# EAGLE design FT230X_LTC4053_PROTO_BB_MINI_USB_B_V1a (EAGLE 5.07)
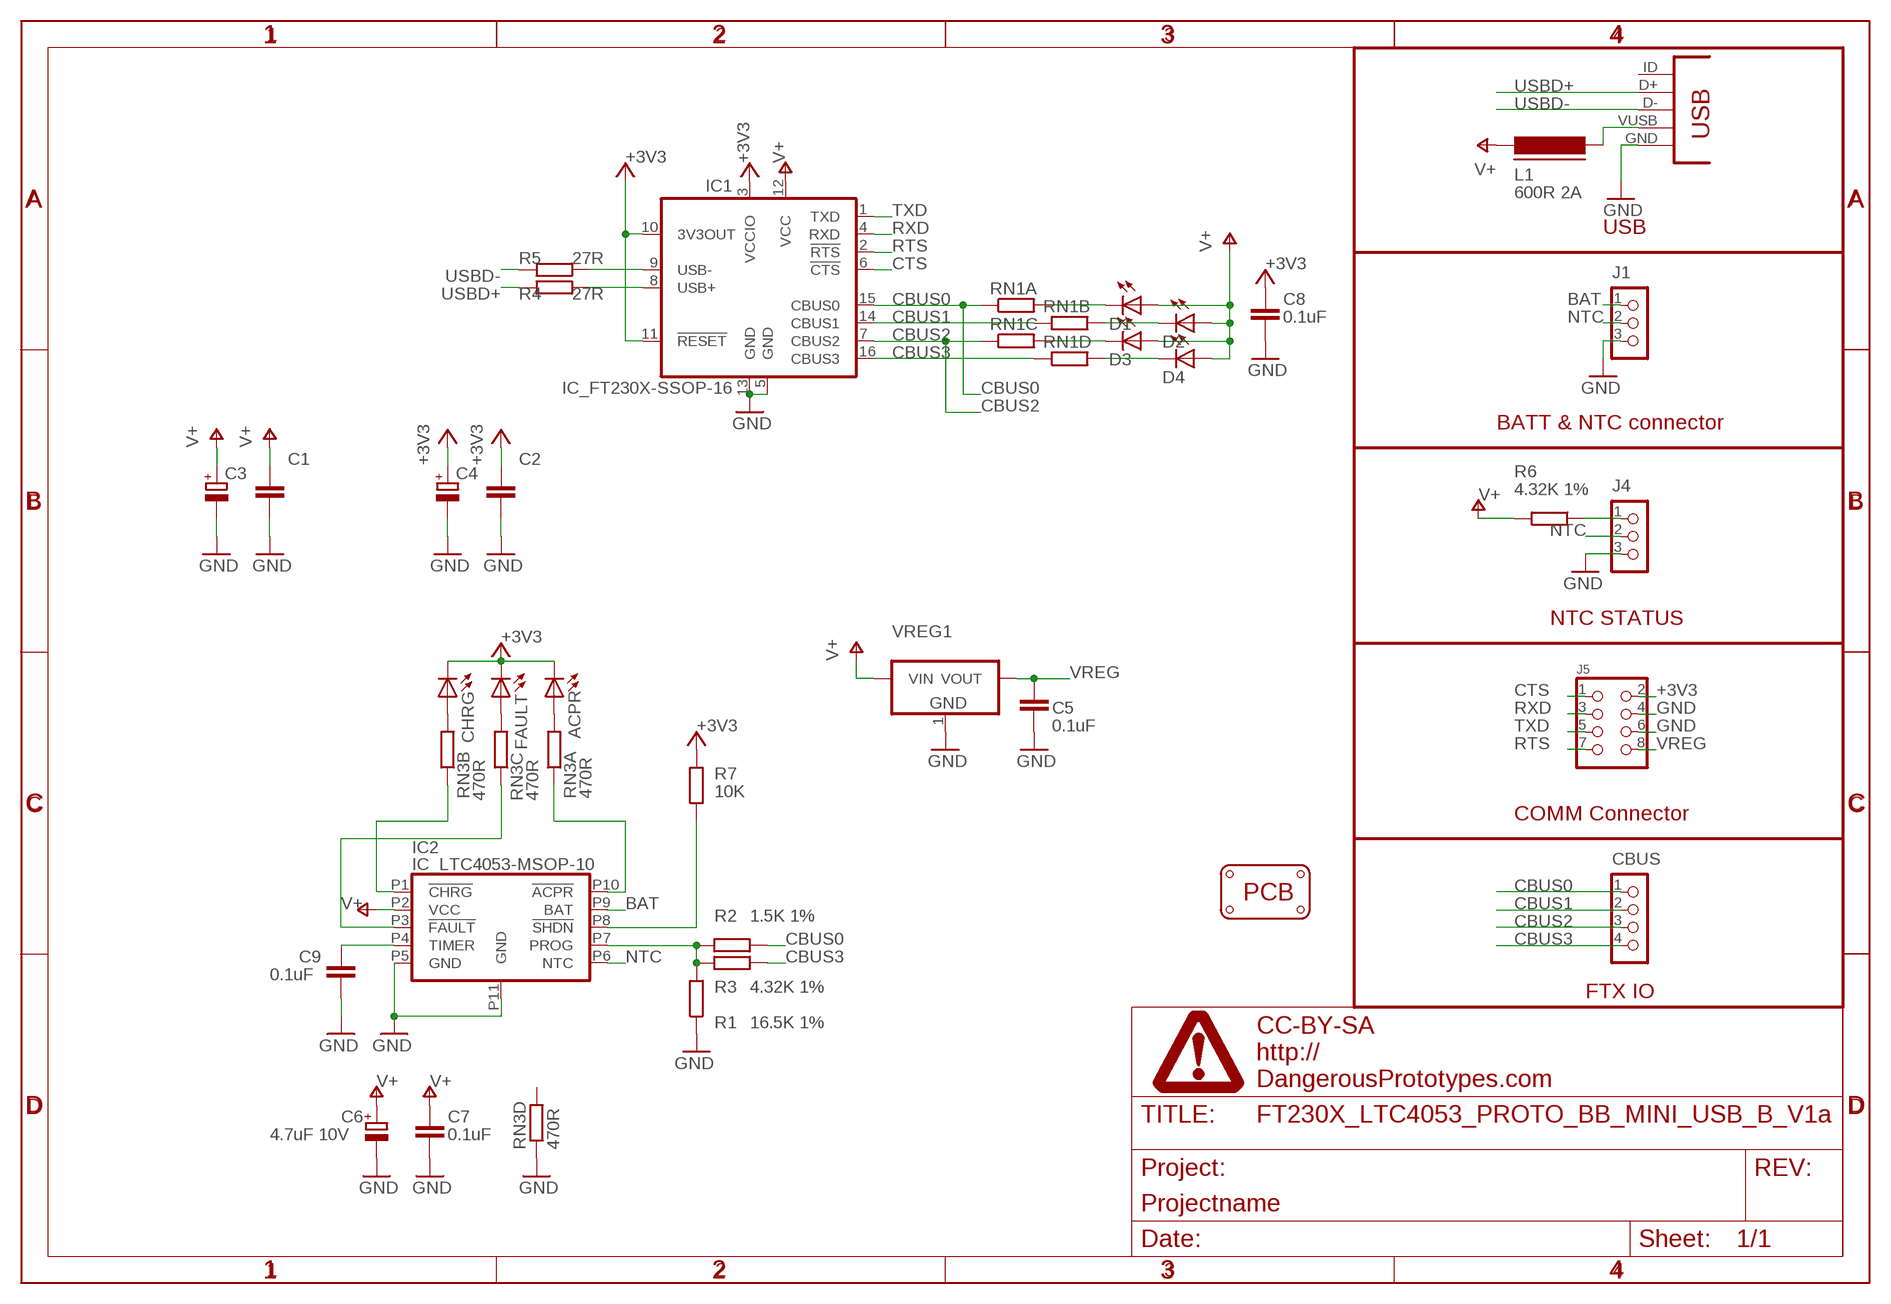
[diagram p0: schematic, sheet 1]

## Parts
ACPR  LED-0805  [LED-805]
C1  CAPACITOR_NPOL-0603  [C603]
C2  CAPACITOR_NPOL-0603  [C603]
C3  CAPACITOR_POL-SMC_A  [SMC_A]
C4  CAPACITOR_POL-SMC_A  [SMC_A]
C5  0.1uF  CAPACITOR_NPOL-0603  [C603]
C6  4.7uF 10V  CAPACITOR_POL-SMC_A  [SMC_A]
C7  0.1uF  CAPACITOR_NPOL-0603  [C603]
C8  0.1uF  CAPACITOR_NPOL-0603  [C603]
C9  0.1uF  CAPACITOR_NPOL-0603  [C603]
CBUS  CON_HEADER_1X04  [M1X4]
CHRG  LED-0805  [LED-805]
D1  LED-0805  [LED-805]
D2  LED-0805  [LED-805]
D3  LED-0805  [LED-805]
D4  LED-0805  [LED-805]
FAULT  LED-0805  [LED-805]
IC1  IC_FT230X-SSOP-16  [SSOP-16-FTDI]
IC2  IC_LTC4053-MSOP-10  [MSOP-10]
J1  CON_HEADER_1X03-PTH  [M1X3]
J4  CON_HEADER_1X03-PTH  [M1X3]
J5  CON_HEADER_2X04-PTH  [M2X4]
L1  600R 2A  FERRITE-0603  [FB603]
PCB2  PCB_DP_RECTANGLE-43X70  [DP7043_V1]
R1  16.5K 1%  RESISTOR-0603  [R603]
R2  1.5K 1%  RESISTOR-0603  [R603]
R3  4.32K 1%  RESISTOR-0603  [R603]
R4  27R  RESISTOR-0603  [R603]
R5  27R  RESISTOR-0603  [R603]
R6  4.32K 1%  RESISTOR-0603  [R603]
R7  10K  RESISTOR-0603  [R603]
RN1  RESISTOR_ARRAY_4  [RN8P-4R-CRA06S]
RN3  470R  RESISTOR_ARRAY_4  [RN8P-4R-CRA06S]
U$1  FRAME_DINA4_L  [DP_LOGO]
U$4  PROTO_VIAS_05X05  [PROTO_VIAS_05X05]  (not placed on a sheet)
U$6  PROTO_VIAS_05X05  [PROTO_VIAS_05X05]  (not placed on a sheet)
U$7  PROTO_VIAS_05X05  [PROTO_VIAS_05X05]  (not placed on a sheet)
U$8  PROTO_VIAS_05X05  [PROTO_VIAS_05X05]  (not placed on a sheet)
U$9  PROTO_VIAS_05X05  [PROTO_VIAS_05X05]  (not placed on a sheet)
U$10  PROTO_VIAS_05X05  [PROTO_VIAS_05X05]  (not placed on a sheet)
USB1  CON-USB-F-MINI-B  [CONN_USB_MINI-B]
VREG1  IC_VREG_3PINS-DPAK  [DPAK]

## Nets
+3V3: ACPR.C C2.1 C4.+ C8.1 CHRG.C FAULT.C IC1.3(VCCIO) IC1.10(3V3OUT) IC1.11(!RESET) J5.2 R7.2
BAT: IC2.P9(BAT) J1.1
CBUS0: CBUS.1 IC1.15(CBUS0) R2.2 RN1.1
CBUS1: CBUS.2 IC1.14(CBUS1) RN1.2
CBUS2: CBUS.3 IC1.7(CBUS2) RN1.3
CBUS3: CBUS.4 IC1.16(CBUS3) R3.2 RN1.4
CTS: IC1.6(!CTS) J5.1
GND: C1.2 C2.2 C3.- C4.- C5.2 C6.- C7.2 C8.2 C9.2 IC1.5(GND) IC1.13(GND) IC2.P5(GND) IC2.P11(GND) J1.3 J4.3 J5.4 J5.6 R1.1 RN3.4 USB1.GND VREG1.1(GND)
N$1: IC2.P10(!ACPR) RN3.1
N$2: IC2.P7(PROG) R1.2 R2.1 R3.1
N$3: IC2.P1(!CHRG) RN3.2
N$4: IC2.P3(!FAULT) RN3.3
N$5: D1.C RN1.8
N$6: D2.C RN1.7
N$7: D3.C RN1.6
N$8: D4.C RN1.5
N$9: IC2.P8(!SHDN) R7.1
N$10: J4.1 R6.1
N$11: IC1.8(USB+) R4.2
N$12: IC1.9(USB-) R5.2
N$13: C9.1 IC2.P4(TIMER)
N$14: FAULT.A RN3.6
N$15: CHRG.A RN3.7
N$16: ACPR.A RN3.8
NTC: IC2.P6(NTC) J1.2 J4.2
RTS: IC1.2(!RTS) J5.7
RXD: IC1.4(RXD) J5.3
TXD: IC1.1(TXD) J5.5
USBD+: R4.1 USB1.D+
USBD-: R5.1 USB1.D-
V+: C1.1 C3.+ C6.+ C7.1 D1.A D2.A D3.A D4.A IC1.12(VCC) IC2.P2(VCC) L1.1 R6.2 VREG1.3(VIN)
VREG: C5.1 J5.8 VREG1.2(VOUT)
VUSBE: L1.2 USB1.VUSB
Unconnected: RN3.5 USB1.BODY@1(BODY) USB1.BODY@2(BODY) USB1.BODY@3(BODY) USB1.BODY@4(BODY) USB1.ID(USBID)

## Notes on the sheet
- USB
- BATT & NTC connector
- NTC STATUS
- COMM Connector
- FTX IO

## Library data of the parts
ACPR CHRG D1-D4 FAULT = dp_devices:LED: Light Emitting Diode
C1 C2 C5 C7-C9 = dp_devices:CAPACITOR_NPOL: Non-Polarized capacitor in various packages
C3 C4 C6 = dp_devices:CAPACITOR_POL: Polarized capacitor in various packages
CBUS = dp_devices:CON_HEADER_1X04
IC1 = dp_devices:IC_FT230X: BASIC USB to UART IC
IC2 = dp_devices:IC_LTC4053: USB Compatible Li-Ion Battery Charger
J1 J4 = dp_devices:CON_HEADER_1X03
J5 = dp_devices:CON_HEADER_2X04
L1 = dp_devices:FERRITE: Ferrite bead in various packages
PCB2 = dp_devices:PCB_DP_RECTANGLE: Dangerous Prototypes Standard Rectangular PCB sizes
R1-R7 = dp_devices:RESISTOR
RN1 RN3 = dp_devices:RESISTOR_ARRAY_4: 4 Resistor Array 0603
U$1 = dp_devices:FRAME_DINA4_L: A4 DP frame Standard Dangerous Prototypes schematic frame. Automagically adds the DP logo and standard texts to the PCB Use the atrribute in the schematic editor to change the fields.; FF1: fulfillment by; FF2: Seeed Studio; FF3: www.seeedstudio.com; LICENSE: CC-BY-SA; PROJECT: Projectname; URL1: http://; URL2: DangerousPrototypes.com
U$4 U$6-U$10 = dp_devices:PROTO_VIAS_05X05: 5x5 square pad 0.04 inch prototyping block
USB1 = dp_devices:CON-USB-F: USB Female connector
VREG1 = dp_devices:IC_VREG_3PINS: Various 3 pin voltage regulators in different packages Double check the right pinout for the right part

## Board
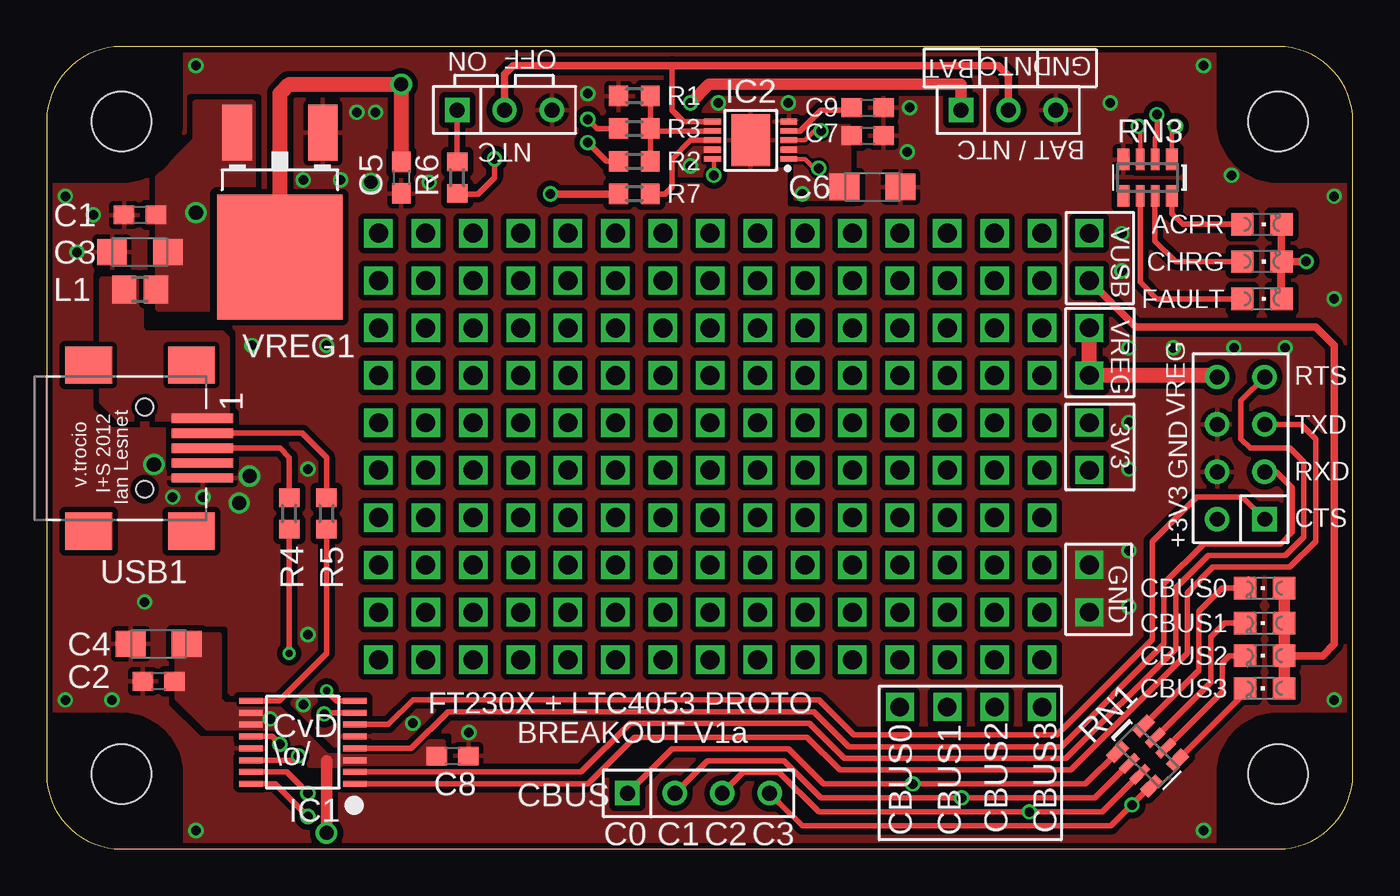
[diagram p1: board, top side]
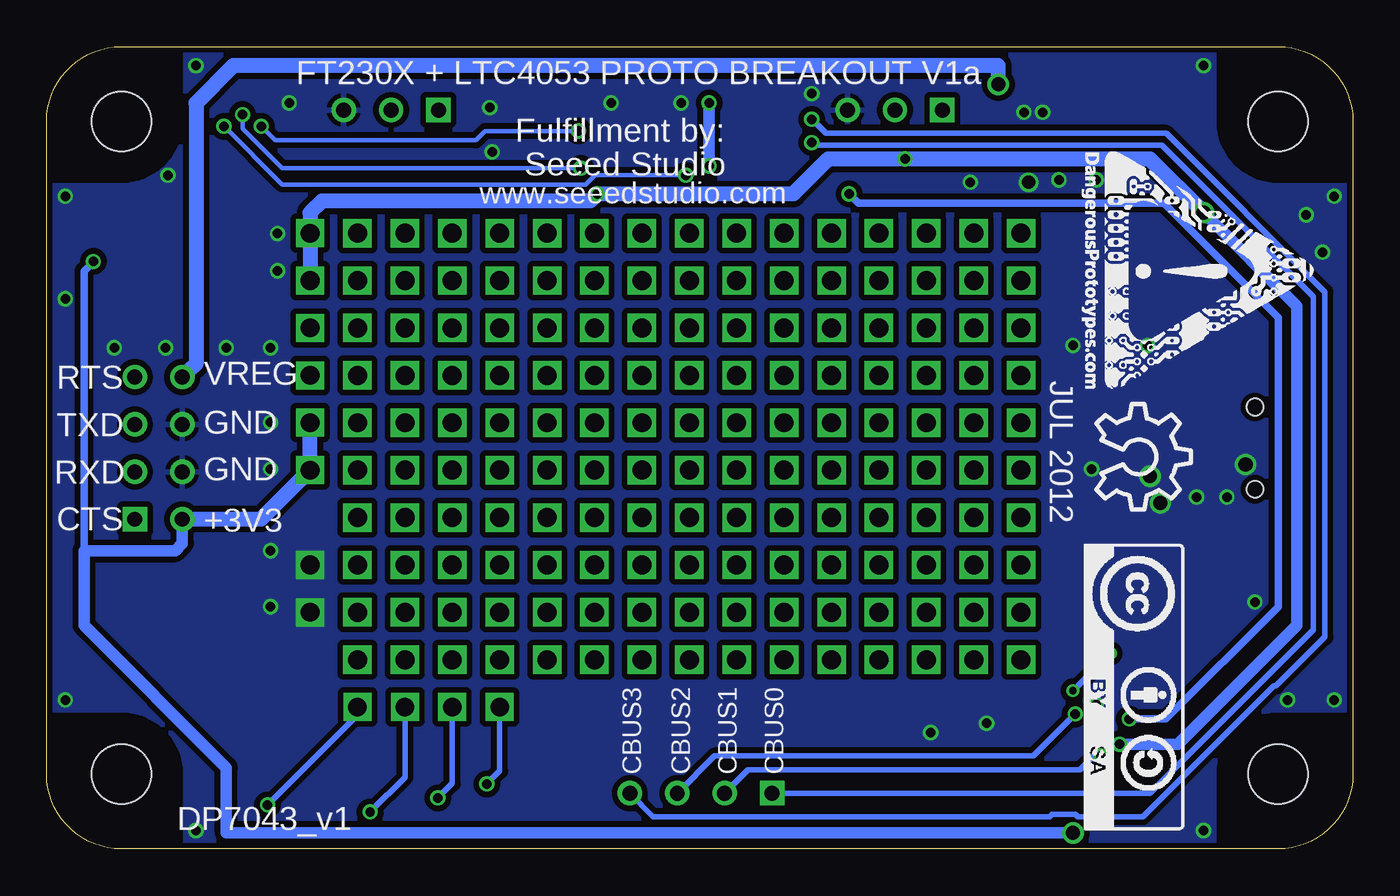
[diagram p2: board, bottom side, seen from below]

Size 70 x 43 mm. Coordinates in mm from the lower left corner, seen from the top.
Copper layers (1*16): Top 0.035mm / dielectric 1.5mm / Bottom 0.035mm
Design rules "Fusion_eagle_rule_v1.1": minimum track width 6mil, minimum drill 12mil, track to track 6mil, track to pad 6mil, pad to pad 6mil, via to via 6mil, smd to smd 0mil, copper to edge 10mil, drill to drill 10mil, minimum pad ring 10mil, minimum via ring 6mil, stop-mask expansion 2mil, vias tented up to drill 100mil, thermal gap 10mil

### Footprints (pad centres in the part's own frame; a part is rotated, then mirrored left to right if it is on the bottom)
LED-805 = smd 1.2 x 1.2: A 0,-1.05; C 0,1.05
C603 = smd 1.1 x 1: 1 -0.85,0; 2 0.85,0
SMC_A = smd 1.6 x 1.4: + -1.5,0; - 1.5,0
M1X4 = drill 0.8 square: 1 0,0 | drill 0.8 round: 2 2.54,0; 3 5.08,0; 4 7.62,0
SSOP-16-FTDI = smd 0.32 x 1.26: 1 -2.223,-2.779; 2 -1.588,-2.779; 3 -0.953,-2.779; 4 -0.318,-2.779; 5 0.317,-2.779; 6 0.952,-2.779; 7 1.587,-2.779; 8 2.222,-2.779; 9 2.222,2.779; 10 1.587,2.779; 11 0.952,2.779; 12 0.317,2.779; 13 -0.318,2.779; 14 -0.953,2.779; 15 -1.588,2.779; 16 -2.223,2.779
MSOP-10 = smd 0.31 x 0.89: P1 -1,-2.045; P2 -0.5,-2.045; P3 0,-2.045; P4 0.5,-2.045; P5 1,-2.045; P6 1,2.045; P7 0.5,2.045; P8 0,2.045; P9 -0.5,2.045; P10 -1,2.045 | smd 2.79 x 2.08: P11 0,0
M1X3 = drill 0.8 square: 1 0,0 | drill 0.8 round: 2 2.54,0; 3 5.08,0
M2X4 = drill 0.8 square: 1 -3.81,-1.27 | drill 0.8 round: 2 -3.81,1.27; 3 -1.27,-1.27; 4 -1.27,1.27; 5 1.27,-1.27; 6 1.27,1.27; 7 3.81,-1.27; 8 3.81,1.27
FB603 = smd 1.3 x 1.5: 1 -0.85,0; 2 0.85,0
DP7043_V1 = hole 3.2: 4,4; 66,4; 66,39; 4,39
R603 = smd 1 x 1.1: 1 -0.85,0; 2 0.85,0
RN8P-4R-CRA06S = smd 0.63 x 1.15: 1 -1.295,-0.975; 4 1.295,-0.975; 5 1.295,0.975; 8 -1.295,0.975 | smd 0.44 x 1.15: 2 -0.4,-0.975; 3 0.4,-0.975; 6 0.4,0.975; 7 -0.4,0.975
PROTO_VIAS_05X05 = drill 1.016 square: 1 -5.08,5.08; 2 -2.54,5.08; 3 0,5.08; 4 2.54,5.08; 5 5.08,5.08; 6 -5.08,2.54; 7 -2.54,2.54; 8 0,2.54; 9 2.54,2.54; 10 5.08,2.54; 11 -5.08,0; 12 -2.54,0; 13 0,0; 14 2.54,0; 15 5.08,0; 16 -5.08,-2.54; 17 -2.54,-2.54; 18 0,-2.54; 19 2.54,-2.54; 20 5.08,-2.54; 21 -5.08,-5.08; 22 -2.54,-5.08; 23 0,-5.08; 24 2.54,-5.08; 25 5.08,-5.08
CONN_USB_MINI-B = smd 2 x 2.5: BODY@1 -4.45,2.5; BODY@2 4.45,2.5; BODY@3 4.45,-3; BODY@4 -4.45,-3 | smd 0.5 x 3.3: D+ 0,3.1; D- -0.8,3.1; GND 1.6,3.1; ID 0.8,3.1; VUSB -1.6,3.1 | hole 0.9: -2.2,0; 2.2,0
DPAK = smd 1.6 x 3: 1 -2.3,-6.65; 3 2.3,-6.65 | smd 6.7 x 6.7: 2 0,0

### Placement (x,y rotation side)
ACPR  65.12,33.48 270 top
C1  5,33.98 180 top
C2  6,8.98 180 top
C3  5,31.98 180 top
C4  6,10.98 180 top
C5  19,35.98 270 top
C6  44.25,35.48 0 top
C7  44,38.23 0 top
C8  21.75,4.98 0 top
C9  44,39.73 0 top
CBUS  31.12,2.98 0 top
CHRG  65.12,31.48 270 top
D1  65.27,13.98 90 top
D2  65.27,12.11 90 top
D3  65.27,10.36 90 top
D4  65.27,8.61 90 top
FAULT  65.12,29.48 270 top
IC1  13.73,5.71 90 top
IC2  37.73,37.98 90 top
J1  49,39.6 0 top
J4  22,39.6 0 top
J5  64,21.48 90 top
L1  5,29.98 180 top
PCB2  0,0 0 top
R1  31.5,40.35 0 top
R2  31.5,36.85 180 top
R3  31.5,38.6 180 top
R4  13,17.98 270 top
R5  15,17.98 270 top
R6  22,35.98 270 top
R7  31.5,35.1 180 top
RN1  59,4.98 315 top
RN3  59,35.98 180 top
U$1  75.3,13.51 0 top  (outside the outline)
U$2  [CC-BY-SA]  14.39,16.34 270 bottom
U$3  [DP_LOGO_ART_0.5X0.5]  14.5,37.35 270 bottom
U$4  22.86,15.22 0 top
U$5  [OSHW_10X200_NOTEXT]  13.75,23.86 270 bottom
U$6  35.56,15.22 0 top
U$7  48.26,15.22 0 top
U$8  22.86,27.92 0 top
U$9  35.56,27.92 0 top
U$10  48.26,27.92 0 top
USB1  5.25,21.48 270 top
VREG1  12.5,31.73 180 top

### Tracks (layer width: path | path; a pad name or v marks a point on that pad's centre or on a via)
+3V3  (via drill 0.51, 0.76, 1)
  Top 0.406: CHRG.C ACPR.C | CHRG.C FAULT.C 66.17,29.93 66.12,29.98 66.12,31.48 v67.5,31.48 CHRG.C | v27,35.1 R7.2
  Top 0.61: v15,0.85 15,4.73
  Bottom 0.406: v11.98,6.96 10.02,6.96 4,12.98 4,28.48 10.12,34.6 26.5,34.6 v27,35.1 | v67.5,31.48 68,30.98 68,15.98
  Bottom 0.61: J5.2 62.73,16.38 63.12,15.98 68,15.98 68,11.98 60.38,4.36 60.38,0.85 v15,0.85
  Bottom 0.813: v55.88,22.84 v55.88,20.3 58.51,17.67 J5.2
  pour Top (no thermals): 7,11.48 9.25,11.48 9.25,7.98 9.5,7.73 12.25,7.73 15,4.98 19.62,4.98 20.38,5.73 21.25,5.73 21.25,4.48 14.12,4.48 12.12,6.48 8.62,6.48 7,8.11
BAT  (via drill 0.51)
  Top 0.61: v34.5,39.98 35.5,40.98 49,40.98 J1.1
  Bottom 0.61: v34.5,36.6 v34.5,39.98
  pour Top (no thermals): 36,37.73 36,36.1 33.88,36.1 33.88,37.73
CBUS0  (via drill 0.51, 1)
  Top 0.305: CBUS.1 33.5,5.36 39.75,5.36 41.62,3.48 v46.41,3.48 55.67,3.48 RN1.1 | R2.2 30,36.85 v29,37.85 | IC1.15 12.86,4.12 v14,2.98
  Bottom 0.305: CBUS.1 v14,2.98 10.88,2.98 2.12,11.73 2.12,29.61 10.25,37.73 28.88,37.73 v29,37.85 | v45.72,7.6 45.72,4.18 v46.41,3.48
CBUS1  (via drill 0.51, 1)
  Top 0.305: CBUS.2 35.41,4.73 39.5,4.73 41.5,2.73 v49.04,2.73 56.18,2.73 RN1.2 | IC1.14 13.28,4.76 v13.5,4.98
  Bottom 0.305: CBUS.2 32.41,4.23 14.62,4.23 13.88,4.98 v13.5,4.98 | v48.26,7.6 48.26,3.51 v49.04,2.73
CBUS2  (via drill 0.51, 1)
  Top 0.305: CBUS.3 37.33,4.11 39.25,4.11 41.38,1.98 v52.66,1.98 56.57,1.98 RN1.3 | IC1.7 14.94,7.3 v14.88,7.23
  Bottom 0.305: CBUS.3 34.2,4.98 17.12,4.98 v14.88,7.23 | v50.8,7.6 50.8,3.85 v52.66,1.98
CBUS3  (via drill 0.51, 1)
  Top 0.305: v14,1.73 12.38,3.35 12.31,3.42 12.24,3.49 IC1.16 | CBUS.4 39.04,2.69 39.25,2.48 40.5,1.23 57.04,1.23 v58.16,2.35 59.19,3.38 RN1.4 | R3.2 29.5,38.6 v29,39.1
  Bottom 0.305: CBUS.4 37.49,1.73 16.25,1.73 16.12,1.85 14.88,1.85 14.75,1.73 v14,1.73 11.25,1.73 4.25,8.73 4.12,8.73 1.5,11.36 1.5,29.86 10,38.35 28.25,38.35 v29,39.1 | v53.34,7.6 53.34,7.18 v58.16,2.35
CTS
  Top 0.305: J5.1 64.08,18.86 61.62,18.86 59.25,16.48 59.25,11.23 54.12,6.11 43.25,6.11 41.38,7.98 19.62,7.98 18.31,6.66 IC1.6
GND  (via drill 0.51, 0.7, 0.76, 1)
  other vias: 15,26.98 11,26.98 14,11.48 22.62,6.23 69,34.98 62,41.98 8,41.98 1,34.98 1,7.98 8,0.98 62,0.98 69,7.98 63.5,36.1 20.5,35.73 17.62,39.48 10.88,19.98 5.75,20.61 8.38,18.86 10.32,18.54 6.75,18.86 16.62,39.48 13.75,35.85 15.75,35.85 39.75,39.98 46.12,37.35 3.5,7.98 46.25,39.73 5.25,13.23 2.5,33.98 1.62,31.98 19.62,6.73 17.38,35.73 14,20.36 57,39.98 36,39.98 29,40.48 55.88,15.22 55.88,12.68 60.38,26.86 58,26.86 63.62,26.86 66.38,26.86 58,22.86 58,20.36 58,15.98 58,12.98 57.62,32.98 57.62,30.98 69,29.48 13.75,7.73
  pour Bottom (isolate 0.305): 0,42.98 0,-0.02 70,-0.02 70,42.98
  pour Top (isolate 0.305, rank 6): 0,42.98 0,-0.02 70,-0.02 70,42.98
N$1  (via drill 0.51)
  Top 0.254: IC2.P10 35.75,36.98 v35.75,36.1 | 60.38,38.6 v60.5,38.73 60.3,38.52 RN3.1
  Bottom 0.254: v35.75,36.1 40.62,36.1 41.12,35.6 57.38,35.6 v60.5,38.73
N$2
  Top 0.305: 32.5,40.35 R1.2 R3.1 | IC2.P7 32.48,38.48 R3.1 | R2.1 R3.1
N$3  (via drill 0.51)
  Top 0.254: IC2.P1 40.62,36.98 41.12,36.48 v41.38,36.48 | v59.5,39.35 59.5,38.23 59.4,38.13 RN3.2
  Bottom 0.254: v41.38,36.48 57.38,36.48 59.5,38.6 v59.5,39.35
N$4  (via drill 0.51)
  Top 0.254: IC2.P3 40.62,37.98 41.12,38.48 v41.5,38.48 | RN3.3 58.6,38.63 v58.5,38.73
  Bottom 0.254: v41.5,38.48 46.5,38.48 47,37.98 57.75,37.98 v58.5,38.73
N$5
  Top 0.305: 64.39,14.48 D1.C 63,13.98 61.75,12.73 61.75,9.56 RN1.8
N$6
  Top 0.305: 64.39,12.48 D2.C 63.12,12.11 62.38,11.36 62.38,8.92 RN1.7
N$7
  Top 0.305: RN1.6 63,8.41 63,9.98 63.38,10.36 D3.C
N$8
  Top 0.305: RN1.5 64.22,8.37 D4.C
N$9
  Top 0.305: IC2.P8 34.5,37.98 33.5,36.98 33.5,35.48 33.12,35.1 R7.1
N$10
  Top 0.305: R6.1 J4.1
N$11  (via drill 0.38)
  Top 0.305: IC1.8 15.55,7.93 v15,8.48 | v13,10.48 R4.2
  Bottom 0.305: v15,8.48 v13,10.48
N$12
  Top 0.305: IC1.9 12.45,7.93 15,10.48 R5.2
N$13
  Top 0.305: IC2.P4 40.38,38.48 41.5,39.6 43.02,39.6 C9.1
N$14
  Top 0.305: FAULT.A 59.5,29.48 58.6,30.38 RN3.6
N$15
  Top 0.305: CHRG.A 60.5,31.48 59.4,32.58 RN3.7
N$16
  Top 0.305: ACPR.A 60.88,33.48 60.3,34.06 RN3.8
NTC
  Top 0.305: IC2.P6 34.12,38.98 33.5,39.6 33.5,41.98
  Top 0.406: J1.2 51.54,41.44 51,41.98 33.5,41.98 25,41.98 24.54,41.52 J4.2
RTS
  Top 0.305: J5.7 64,24.02 64,21.98 64.5,21.48 66.62,21.48 67.38,20.73 67.38,16.73 66.38,15.73 62.25,15.73 60.5,13.98 60.5,10.73 54.62,4.86 42.75,4.86 40.88,6.73 31.25,6.73 28.64,4.12 IC1.2
RXD
  Top 0.305: J5.3 65.89,20.21 66.75,19.36 66.75,16.98 66.12,16.36 62,16.36 59.88,14.23 59.88,10.98 54.38,5.48 43,5.48 41.12,7.36 21.5,7.36 19.54,5.39 IC1.4
TXD
  Top 0.305: J5.5 67.23,22.75 68,21.98 68,16.48 66.62,15.11 62.5,15.11 61.12,13.73 61.12,10.48 54.88,4.23 42.5,4.23 40.75,5.98 31.5,5.98 29.01,3.49 IC1.1
USBD+
  Top 0.305: USB1.D+ 12.5,21.48 13,20.98 R4.1
USBD-
  Top 0.305: USB1.D- 13.7,22.28 15,20.98 R5.1
V+  (via drill 0.51, 0.76, 1)
  Top 0.305: R6.2 22,35.1 23.12,35.1 24,35.98 v24,36.98 | IC1.12 12.08,6.03 v12.5,5.61
  Top 0.406: D2.A 66.44,11.98 | v55.88,30.46 58.36,27.98 68,27.98 69,26.98 69,10.98 68.38,10.36 D3.A
  Top 0.61: D1.A D2.A D3.A D4.A | C7.1 43,38.23 | C6.+ 43,35.23
  Bottom 0.61: v8,34.1 3,29.11 3,11.98 9.38,5.61 v12.5,5.61
  Bottom 0.813: v8,34.1 10.88,36.98 v24,36.98 28.12,36.98 30,35.1 v40.5,35.1 40.88,34.73 55.25,34.73 55.88,34.1 v55.88,33 v55.88,30.46
  pour Top (isolate 0.406, no thermals): 6,28.98 6,35.98 8,37.98 8,39.98 11,39.98 11,29.98 10,28.98
  pour Top (no thermals): 39.5,36.98 39.5,37.98 41.88,37.98 41.88,38.73 43,38.73 43,34.85 40.12,34.85 40.12,36.98
VREG  (via drill 0.76, 1)
  Top 0.813: VREG1.2 12.75,31.73 12.5,31.98 12.5,40.48 13,40.98 v19,40.98 C5.1 | v55.88,27.92 v55.88,25.38 62.64,25.38 J5.8
  Bottom 0.813: J5.8 62,25.98 62,39.98 60,41.98 19,41.98 v19,40.98
VUSBE
  pour Top (isolate 0.254, no thermals): 9.62,23.11 3.88,23.11 3,23.98 3,30.48 5,30.48 5,27.86 5.25,27.61 9.38,27.61 9.62,27.36

### Text on the board
tPlace: ON | OFF | BAT | NTC | GND | NTC | BAT / NTC | VUSB | VREG | VREG | RTS | 3V3 | GND | TXD | +3V3 | RXD | v.trocio | I+S 2012 | Ian Lesnet | CTS | GND | CBUS0 | CBUS1 | CBUS2 | CBUS3 | FT230X + LTC4053 PROTO | CvD | BREAKOUT V1a | \\o/ | CBUS0 | CBUS1 | CBUS2 | CBUS3 | C0 | C1 | C2 | C3
bPlace: FT230X + LTC4053 PROTO BREAKOUT V1a | Fulfillment by: | Seeed Studio | www.seeedstudio.com | JUL 2012 | VREG | RTS | GND | TXD | GND | RXD | +3V3 | CTS | CBUS0 | CBUS1 | CBUS2 | CBUS3